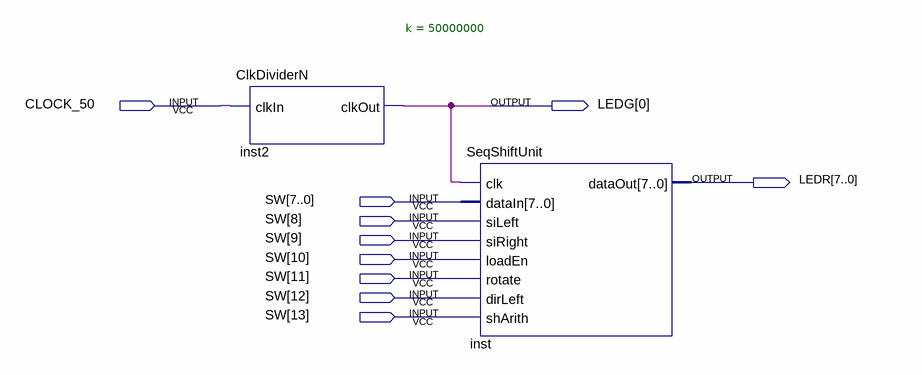
[diagram p0: schematic sheet]
// Quartus schematic SeqShiftUnit_Demo.bdf as structural Verilog: 2 symbols, 10 pins
module SeqShiftUnit_Demo (
  input  CLOCK_50,
  input  [13:0] SW,
  output [0:0] LEDG,
  output [7:0] LEDR
);

  ClkDividerN #(.k(50000000)) inst2 (.clkIn(CLOCK_50), .clkOut(LEDG[0]));
  SeqShiftUnit inst (
    .clk(LEDG[0]), .dataIn(SW[7:0]), .siLeft(SW[8]), .siRight(SW[9]), .loadEn(SW[10]), .rotate(SW[11]),
    .dirLeft(SW[12]), .shArith(SW[13]), .dataOut(LEDR));
endmodule
